# Altium schematic sheet mpu_lpddr4.SchDoc
size A; SheetNumber: 6; SheetTotal: 6
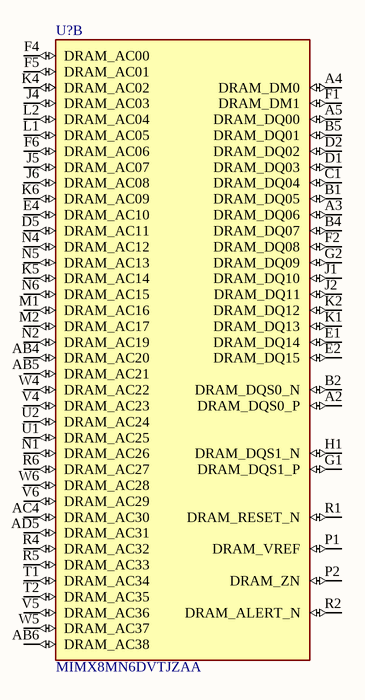
[diagram p0: mpu_lpddr4.SchDoc]

## Parts
U?  MIMX8MN6DVTJZAA  [BGA486N50P27X27_1400X1400X125N]  (part B of 8)

## Nets

Not connected (* = marked no-connect by the designer): U? A2(DRAM_DQS0_P) A3(DRAM_DQ06) A4(DRAM_DM0) A5(DRAM_DQ00) AB4(DRAM_AC20) AB5(DRAM_AC21) AB6(DRAM_AC38) AC4(DRAM_AC30) AD5(DRAM_AC31) B1(DRAM_DQ05) B2(DRAM_DQS0_N) B4(DRAM_DQ07) B5(DRAM_DQ01) C1(DRAM_DQ04) D1(DRAM_DQ03) D2(DRAM_DQ02) D5(DRAM_AC11) E1(DRAM_DQ14) E2(DRAM_DQ15) E4(DRAM_AC10) F1(DRAM_DM1) F2(DRAM_DQ08) F4(DRAM_AC00) F5(DRAM_AC01) F6(DRAM_AC06) G1(DRAM_DQS1_P) G2(DRAM_DQ09) H1(DRAM_DQS1_N) J1(DRAM_DQ10) J2(DRAM_DQ11) J4(DRAM_AC03) J5(DRAM_AC07) J6(DRAM_AC08) K1(DRAM_DQ13) K2(DRAM_DQ12) K4(DRAM_AC02) K5(DRAM_AC14) K6(DRAM_AC09) L1(DRAM_AC05) L2(DRAM_AC04) M1(DRAM_AC16) M2(DRAM_AC17) N1(DRAM_AC26) N2(DRAM_AC19) N4(DRAM_AC12) N5(DRAM_AC13) N6(DRAM_AC15) P1(DRAM_VREF) P2(DRAM_ZN) R1(DRAM_RESET_N) R2(DRAM_ALERT_N) R4(DRAM_AC32) R5(DRAM_AC33) R6(DRAM_AC27) T1(DRAM_AC34) T2(DRAM_AC35) U1(DRAM_AC25) U2(DRAM_AC24) V4(DRAM_AC23) V5(DRAM_AC36) V6(DRAM_AC29) W4(DRAM_AC22) W5(DRAM_AC37) W6(DRAM_AC28)

## Library data of the parts
U? = MIMX8MN6DVTJZAA: ARMÂ® CortexÂ®-A53 Microprocessor IC i.MX8MN 4 Core, 32-Bit 1.5GHz 486-LFBGA (14x14); MF: NXP USA Inc.; Package: LFBGA-486 NXP USA Inc.; Price: None; Mouser-Purchase-URL: https://snapeda.com/shop?store=Mouser&id=4467530; Availability: Warning; MP: MIMX8MN6DVTJZAA; SnapEDA_Link: https://www.snapeda.com/parts/MIMX8MN6DVTJZAA/NXP%20Semiconductors/view-part/4467530/?ref=snap; Value: *; Arrow_Electronics-Purchase-URL: https://snapeda.com/shop?store=Arrow+Electronics&id=4467530; BuyPart: https://www.snapeda.com/parts/MIMX8MN6DVTJZAA/NXP%20Semiconductors/view-part/4467530/?ref=eda